# Altium schematic sheet 03_ICs.SchDoc: ICs
size A; Revision: A; SheetNumber: 3; SheetTotal: 4; ECE315_Project_Name: ECE453 F23 Base Project
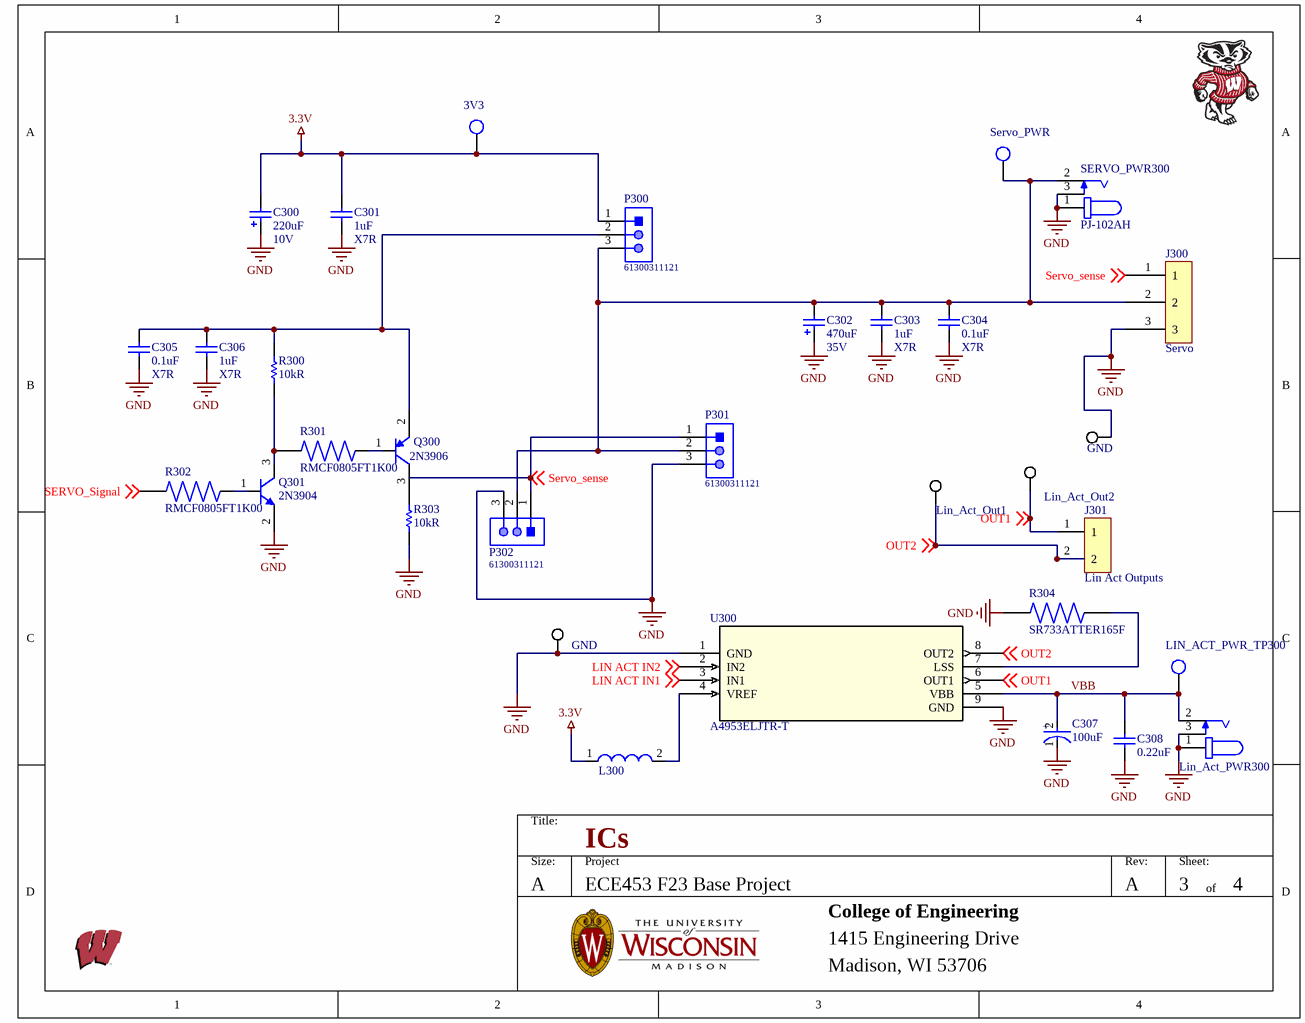
[diagram p0: 03_ICs.SchDoc]

## Parts
(Parts that share a designator on the sheet are numbered #1, #2 ... from top to bottom, then left to right.)
3V3  TP_1206  [TP-SMC-1206]  (value not drawn)
C300  Voltage: 10V  [CAPPR2-5x11]  (hidden comment: 220uF)
C301  Dielectric: X7R  [CAPC2012M]  (hidden comment: 1uF)
C302  Voltage: 35V  [CAPPR5-10x12.5]  (hidden comment: 470uF)
C303  Dielectric: X7R  [CAPC2012M]  (hidden comment: 1uF)
C304  Dielectric: X7R  [CAPC2012M]  (hidden comment: 0.1uF)
C305  Dielectric: X7R  [CAPC2012M]  (hidden comment: 0.1uF)
C306  Dielectric: X7R  [CAPC2012M]  (hidden comment: 1uF)
C307  Capacitance: 100uF  [FP-SD8-MFG]  (hidden comment: EEE-1EA101XP)
C308  0.22uF  [CAPC2012M]
GND#1  5019  [KSTN-5019_V]  (value not drawn)
GND#2  5019  [KSTN-5019_V]  (value not drawn)
J300  Servo  [PHOENIX3X0.2]
J301  Lin Act Outputs  [PHOENIX2X0.2]
L300  742792093  [SMD-0805]  (value not drawn)
Lin_Act_Out1  5019  [KSTN-5019_V]  (value not drawn)
Lin_Act_Out2  5019  [KSTN-5019_V]  (value not drawn)
Lin_Act_PWR300  (no value)  [CUI_PJ-102AH]
LIN_ACT_PWR_TP300  TP_1206  [TP-SMC-1206]  (value not drawn)
P300  61300311121  [61300311121]
P301  61300311121  [61300311121]
P302  61300311121  [61300311121]
Q300  2N3906  [SOT23-3M]
Q301  2N3904  [SOT23-3M]
R300  Resistance: 10kR  [RESC2013X60X35NL10T20]  (hidden comment: RC0805FR-0710KL)
R301  RMCF0805FT1K00  [RESC2012X65N]
R302  RMCF0805FT1K00  [RESC2012X65N]
R303  Resistance: 10kR  [RESC2013X60X35NL10T20]  (hidden comment: RC0805FR-0710KL)
R304  SR733ATTER165F  [RESC6432X70N]
Servo_PWR  TP_1206  [TP-SMC-1206]  (value not drawn)
SERVO_PWR300  PJ-102AH  [CUI_PJ-102AH]
U300  A4953ELJTR-T  [SOIC-8_ALM]

## Nets
3.3V: 3V3.1 C300.2 C301.2 L300.1 P300.1
GND: C300.1 C301.1 C302.1 C303.1 C304.1 C305.1 C306.1 C307.1(C) C308.2 GND#1.1 GND#2.1 J300.3 Lin_Act_PWR300.1 Lin_Act_PWR300.3 P301.3 P302.3 Q301.2(E) R303.1 R304.1 SERVO_PWR300.1 SERVO_PWR300.3 U300.1(GND) U300.9(GND)
LIN ACT IN1: U300.3(IN1) ; off-sheet LIN ACT IN1
LIN ACT IN2: U300.2(IN2) ; off-sheet LIN ACT IN2
OUT1: J301.1 Lin_Act_Out2.1 U300.6(OUT1) ; off-sheet OUT1
OUT2: J301.2 Lin_Act_Out1.1 U300.8(OUT2) ; off-sheet OUT2
Servo_sense: J300.1 P301.1 P302.1 ; off-sheet Servo_sense
SERVO_Signal: R302.1 ; off-sheet SERVO_Signal
VBB: C307.2(A) C308.1 Lin_Act_PWR300.2 LIN_ACT_PWR_TP300.1 U300.5(VBB)
NetC302_2: C302.2 C303.2 C304.2 J300.2 P300.3 P301.2 P302.2 Servo_PWR.1 SERVO_PWR300.2
NetC305_2: C305.2 C306.2 P300.2 Q300.2(E) R300.2
NetL300_2: L300.2 U300.4(VREF)
NetQ300_1: Q300.1(B) R301.2
NetQ300_3: Q300.3(C) R303.2
NetQ301_1: Q301.1(B) R302.2
NetQ301_3: Q301.3(C) R300.1 R301.1
NetR304_2: R304.2 U300.7(LSS)

## Notes on the sheet
- Title:
- Size:
- A
- Project
- Rev:
- Sheet:
- of
- College of Engineering
- 1415 Engineering Drive
- Madison, WI 53706
- (in symbol CMP-05427-000061-1) +

## Library data of the parts
3V3 LIN_ACT_PWR_TP300 Servo_PWR = TP_1206: Test Point SMD 1206; Manufacturer: TE Connectivity (Tyco Electronics); Manufacturer Part Number: 1625854-1; Resistance Value: 0 Ohm; Temperature Coefficient: N/R; Supplier: Digi-Key; Stock 1: 31937; Pricing 1: 1=0.28, 10=0.261, 25=0.224, 50=0.1902, 100=0.1828, 250=0.1641, 500=0.1567, 1000=0.1306 (USD); Case Size: 1206; Dimension: 3.2 x 1.6 x 1.25mm; Family: RC; Mounting: Surface Mount; Operating Temperature: -55 to 125 C; Part No: 1625854-1; RoHS: Yes; Packaging: Tape and Reel; Termination Style: N/R; Terminal Pitch: N/R; Power Rating: N/R; Tolerance: N/R; ComponentLink1URL: https://datasheet.ciiva.com/6439/eng-ds-1773266-a-6439169.pdf; ComponentLink1Description: https://datasheet.ciiva.com/6439/eng-ds-1773266-a-6439169.pdf; ComponentLink2URL: https://datasheet.ciiva.com/30136/1773266-a-30136341.pdf; ComponentLink2Description: https://datasheet.ciiva.com/30136/1773266-a-30136341.pdf; ComponentLink3URL: https://datasheet.ciiva.com/6439/eng-ds-1773266-a-6439080.pdf; ComponentLink3Description: https://datasheet.ciiva.com/6439/eng-ds-1773266-a-6439080.pdf; ComponentLink4URL: https://datasheet.ciiva.com/6439/eng-ds-1773266-a-6439081.pdf; ComponentLink4Description: https://datasheet.ciiva.com/6439/eng-ds-1773266-a-6439081.pdf; ComponentLink5URL: https://datasheet.ciiva.com/6439/eng-ds-1773266-a-6439083.pdf; ComponentLink5Description: https://datasheet.ciiva.com/6439/eng-ds-1773266-a-6439083.pdf; Supplier Part Number: A106143CT-ND
C300 = Cap Pol1: Capacitor Al 105deg 220uF 10V 5X11; Manufacturer: Rubycon; Manufacturer Part Number: 10YXJ220M5X11; Tolerance: 20%; Ripple Current: 250mA; Impedance: 400mR; Leakage Current: 3uA; Life (Hours): 4000Hour; Lead Diameter: 0.5mm; Supplier: Digi-Key; Supplier Part Number: 1189-4150-ND; RoHS: Yes; Category: Aluminum Electrolytic Capacitors; Stock 1: 94; Pricing 1: 1=0.26000, 10=0.17500, 50=0.11680, 100=0.09930, 500=0.07010, 1000=0.06134, 2500=0.05842, 5000=0.05404 (USD); Mount: Through Hole; Case/Package: Radial; Min Operating Temperature: -40°C; Max Operating Temperature: 105°C; Capacitance: 220uF; Termination: Radial; Package Quantity: 3000; Packaging: Bulk; Voltage Rating: 10V; Series: YXJ; Construction: RADIAL; Diameter: 5mm; Height: 11mm; Lead Pitch: 2mm; Height - Seated (Max): 0.492inch; Radiation Hardening: No; RoHS Compliant: Yes; ComponentLink1URL: https://datasheet.ciiva.com/11777/0900766b810307a1-11777018.pdf?src-supplier=RSComponents; ComponentLink1Description: https://datasheet.ciiva.com/11777/0900766b810307a1-11777018.pdf?src-supplier=RSComponents; ComponentLink2URL: https://datasheet.ciiva.com/6318/e-yxj-6318863.pdf?src-supplier=Digi-Key; ComponentLink2Description: https://datasheet.ciiva.com/6318/e-yxj-6318863.pdf?src-supplier=Digi-Key; ComponentLink3URL: https://datasheet.ciiva.com/11690/e-yxj-11690699.pdf?src-supplier=Avnet; ComponentLink3Description: https://datasheet.ciiva.com/11690/e-yxj-11690699.pdf?src-supplier=Avnet; Value: 220uF
C301 C306 = Cap_5: CAP CER 1UF 50V X7R 0805; Manufacturer: Samsung; Manufacturer Part Number: CL21B105KBFNNNE; Tolerance: 10%; Dielectric Material: Ceramic; Value: 1uF; Case Code (Metric): 2012; Min Operating Temperature: -55°C; Mount: Surface Mount; Width: 0.049inch; Voltage Rating (DC): 50V; Voltage Rating: 50V; Height: 1.25mm; Case Code (Imperial): 0805; Supplier: Digi-Key; Supplier Part Number: 1276-1029-6-ND; Capacitance: 1uF; Case/Package: 0805; Construction: Flat; Max Operating Temperature: 125°C; REACH SVHC: No SVHC; Voltage: 50V; Packaging: Tape and Reel; Depth: 1.25mm; Package Quantity: 1; Radiation Hardening: No; Series: CL; Length: 2mm; Thickness: 0.053inch; Termination: SMD/SMT; Number of Pins: 2; RoHS Compliant: Yes
C302 = Cap Pol3: CAP ALUM 470UF 20% 35V RADIAL; Manufacturer: Rubycon; Manufacturer Part Number: 35ZL470MEFC10X20; Leakage Current: 3uA; Lead Diameter: 0.6mm; Dielectric Material: Aluminium; Life (Hours): 4000Hour; Ripple Current: 1.82A; Impedance: 23mR; Case/Package: Radial; Max Operating Temperature: 105°C; REACH SVHC: Unknown; Min Operating Temperature: -40°C; Supplier Part Number: 35ZL470MEFC10X20-ND; Packaging: Bulk; Lead Pitch: 5mm; Diameter: 10mm; Capacitance: 470uF; Lead Free: Lead Free; Radiation Hardening: No; Package Quantity: 1000; Height: 20mm; Voltage Rating: 35V; Mount: Through Hole; Supplier: Digi-Key; Height - Seated (Max): 0.866inch; Tolerance: 20%; Termination: Radial; Value: 470uF
C303 = Cap: CAP CER 1UF 50V X7R 0805; Manufacturer: Samsung; Manufacturer Part Number: CL21B105KBFNNNE; Tolerance: 10%; Dielectric Material: Ceramic; Case Code (Metric): 2012; Min Operating Temperature: -55°C; Mount: Surface Mount; Width: 0.049inch; Voltage Rating (DC): 50V; Voltage Rating: 50V; Height: 1.25mm; Case Code (Imperial): 0805; Supplier: Digi-Key; Supplier Part Number: 1276-1029-6-ND; Capacitance: 1uF; Case/Package: 0805; Construction: Flat; Max Operating Temperature: 125°C; REACH SVHC: No SVHC; Voltage: 50V; Packaging: Tape and Reel; Depth: 1.25mm; Package Quantity: 1; Radiation Hardening: No; Series: CL; Length: 2mm; Thickness: 0.053inch; Termination: SMD/SMT; Number of Pins: 2; RoHS Compliant: Yes; Value: 1uF
C304 C305 = Cap_1: Cap Ceramic 0.1uF 50V X7R 20% SMD 0805 125°C Plastic T/R; Manufacturer: KEMET; Manufacturer Part Number: C0805C104M5RAC7210; Supplier: Digi-Key; Supplier Part Number: 399-C0805C104M5RAC7210CT-ND; RoHS: Yes; Category: Ceramic Capacitors; Stock 1: 29705; Pricing 1: 1=0.10000, 10=0.05900, 50=0.03220, 100=0.02620, 500=0.01874, 1000=0.01472, 2500=0.01338, 5000=0.01231 (USD); Mounting Technology: Surface Mount; Case/Package: 0805; Dielectric Material: Ceramic; Min Operating Temperature: -55°C; Max Operating Temperature: 125°C; Packaging: Tape and Reel; Tolerance: 20%; Voltage Rating (DC): 50V; Construction: Flat; Length: 2mm; Height: 0.9mm; Depth: 1.25mm; Radiation Hardening: No; RoHS Compliant: Yes; ComponentLink1URL: https://datasheet.ciiva.com/26923/getdatasheetpartid-738954-26923963.pdf?src-supplier=Verical; ComponentLink1Description: https://datasheet.ciiva.com/26923/getdatasheetpartid-738954-26923963.pdf?src-supplier=Verical; Value: 0.1uF
C307 = CMP-05427-000061-1: CAP ALUM 100UF 20% 25V SMD; Manufacturer: Panasonic; Leakage Current: 3uA; Life (Hours): 2000Hour; Ripple Current: 143mA; Polarity: Polar; Height - Seated (Max): 0.303inch; Contact Plating: Tin; Max Operating Temperature: 85°C; Package Quantity: 900; RoHS Compliant: Yes; Termination: SMD/SMT; Lead Free: Lead Free; Min Operating Temperature: -40°C; Radiation Hardening: No; Length: 8mm; Height: 7.7mm; Series: S; Voltage Rating: 25V; Diameter: 6.3mm; Ripple Current (AC): 143mA; Case/Package: Radial; Packaging: Tape and Reel; Voltage: 25V; Tolerance: 20%; Construction: Cylindrical; Voltage Rating (DC): 25V; Mount: Surface Mount; Supplier: Newark; Supplier Part Number: 47AC4798; Manufacturer Part Number: EEE-1EA101XP; RoHS: Yes; Category: Aluminum Electrolytic Capacitors; Stock: 12600; Pricing: 1=0.166, 900=0.162, 1800=0.158 (USD); Mounting Technology: Surface Mount,PCB; Value: 100uF; Ratings: AEC-Q200; Reach SVHC Compliant: Unknown; ComponentLink1URL: https://media.digikey.com/pdf/Data%20Sheets/Panasonic%20Electronic%20Components/S_Series,Type_V_Rev2018.pdf?src-supplier=Digi-Key; ComponentLink1Description: https://media.digikey.com/pdf/Data%20Sheets/Panasonic%20Electronic%20Components/S_Series,Type_V_Rev2018.pdf?src-supplier=Digi-Key; ComponentLink2URL: https://industrial.panasonic.com/cdbs/www-data/pdf/RDE0000/DME0000COL90.pdf?src-supplier=Digi-Key; ComponentLink2Description: https://industrial.panasonic.com/cdbs/www-data/pdf/RDE0000/DME0000COL90.pdf?src-supplier=Digi-Key; ComponentLink3URL: https://industrial.panasonic.com/cdbs/www-data/pdf/RDE0000/DME0000COL90.pdf?src-supplier=Arrow+Electronics; ComponentLink3Description: https://industrial.panasonic.com/cdbs/www-data/pdf/RDE0000/DME0000COL90.pdf?src-supplier=Arrow+Electronics
C308 = Cap_2: Cap Ceramic 0.22uF 50V X7R 10% SMD 0805 125°C Plastic T/R; Manufacturer: KEMET; Manufacturer Part Number: C0805C224K5RACAUTO7210; Supplier 1: Digi-Key; Supplier Part Number 1: 399-C0805C224K5RACAUTO7210CT-ND; RoHS: Yes; Category: Ceramic Capacitors; Stock 1: 24243; Pricing 1: 1=0.19000, 10=0.12800, 50=0.07680, 100=0.06490, 500=0.04438, 1000=0.03926, 2500=0.03755, 5000=0.03414 (USD); RoHS Compliant: Yes; Value: 0.22uF
GND#1 GND#2 Lin_Act_Out1 Lin_Act_Out2 = CMP-1672-00008-1: Test Point, 1 Position SMD, RoHS, Tape and Reel; Manufacturer: Keystone Electronics; Plating: Silver; Body Material: Bronze; Supplier: Newark; Supplier Part Number: 59Y8500; Manufacturer Part Number: 5019; RoHS: Yes; Category: Connectors; Stock: 11269; Pricing: 1=0.411, 10=0.389, 25=0.285, 50=0.279, 100=0.273, 250=0.246 (USD); Mounting Technology: Surface Mount,PCB; Pins: 1; Contact Plating: Silver; Contact Material: Bronze; Material: Bronze; Packaging: Tape and Reel; Package Quantity: 1; Termination: SMD/SMT; Series: 5019; Height: 0.09inch; Reach SVHC Compliant: No; RoHS Compliant: Yes; Lead Free: Lead Free; ComponentLink1URL: https://datasheet.ciiva.com/14848/m60-2p61-14848437.pdf?src-supplier=Digi-Key; ComponentLink1Description: https://datasheet.ciiva.com/14848/m60-2p61-14848437.pdf?src-supplier=Digi-Key; ComponentLink2URL: https://datasheet.ciiva.com/14848/m60-2p61-14848438.pdf?src-supplier=Digi-Key; ComponentLink2Description: https://datasheet.ciiva.com/14848/m60-2p61-14848438.pdf?src-supplier=Digi-Key; ComponentLink3URL: https://datasheet.ciiva.com/14848/m60-2p61-14848439.pdf?src-supplier=Digi-Key; ComponentLink3Description: https://datasheet.ciiva.com/14848/m60-2p61-14848439.pdf?src-supplier=Digi-Key; ComponentLink4URL: https://datasheet.ciiva.com/16318/m60-2p61-16318395.pdf?src-supplier=Future+Electronics; ComponentLink4Description: https://datasheet.ciiva.com/16318/m60-2p61-16318395.pdf?src-supplier=Future+Electronics; ComponentLink5URL: https://datasheet.ciiva.com/16885/70182998-16885945.pdf?src-supplier=Allied+Electronics; ComponentLink5Description: https://datasheet.ciiva.com/16885/70182998-16885945.pdf?src-supplier=Allied+Electronics
J300 = 3-Pin_2: 2~24 Poles, Screw Type, Horizontal, 5.08 Pitch, 26~14 (AWG), Terminal Block Connector; Manufacturer: CUI Devices; Manufacturer Part Number: TB006-508-03BE; Supplier 1: Digi-Key; Supplier Part Number 1: 102-6192-ND; RoHS: Yes; Category: Terminal Blocks; Stock 1: 41909; Pricing 1: 1=0.91, 10=0.567, 25=0.4856, 50=0.4364, 100=0.4272, 250=0.3636, 500=0.34542, 1000=0.30906, 5000=0.24179 (USD)
J301 = 2-Pin_2: 2~24 Poles, Screw Type, Horizontal, 5.08 Pitch, 26~14 (AWG), Terminal Block Connector; Manufacturer: CUI Devices; Manufacturer Part Number: TB006-508-02BE; ComponentLink1URL: https://datasheet.ciiva.com/709/eng-cd-640456-w1-709680.pdf?src-supplier=Digi-Key; ComponentLink1Description: https://datasheet.ciiva.com/709/eng-cd-640456-w1-709680.pdf?src-supplier=Digi-Key; ComponentLink2URL: https://datasheet.ciiva.com/3118/eng-ds-82056-mta-0608-3118497.pdf?src-supplier=Avnet; ComponentLink2Description: https://datasheet.ciiva.com/3118/eng-ds-82056-mta-0608-3118497.pdf?src-supplier=Avnet; ComponentLink3URL: https://datasheet.ciiva.com/16401/eng-ds-82056-mta-0608-16401289.pdf?src-supplier=Future+Electronics; ComponentLink3Description: https://datasheet.ciiva.com/16401/eng-ds-82056-mta-0608-16401289.pdf?src-supplier=Future+Electronics; ComponentLink4URL: https://datasheet.ciiva.com/25617/0900766b80027008-25617244.pdf?src-supplier=RSComponents; ComponentLink4Description: https://datasheet.ciiva.com/25617/0900766b80027008-25617244.pdf?src-supplier=RSComponents; ComponentLink5URL: https://datasheet.ciiva.com/14156/04384301-14156820.pdf?src-supplier=Distrelec; ComponentLink5Description: https://datasheet.ciiva.com/14156/04384301-14156820.pdf?src-supplier=Distrelec; ComponentLink6URL: https://datasheet.ciiva.com/11746/0900766b80eb7fdd-11746365.pdf?src-supplier=RSComponents; ComponentLink6Description: https://datasheet.ciiva.com/11746/0900766b80eb7fdd-11746365.pdf?src-supplier=RSComponents; ComponentLink7URL: https://datasheet.ciiva.com/7128/1866390-7128742.pdf?src-supplier=Newark; ComponentLink7Description: https://datasheet.ciiva.com/7128/1866390-7128742.pdf?src-supplier=Newark; ComponentLink8URL: https://datasheet.ciiva.com/16505/eng-ds-82056-mta-0608-16505419.pdf?src-supplier=Avnet+Asia; ComponentLink8Description: https://datasheet.ciiva.com/16505/eng-ds-82056-mta-0608-16505419.pdf?src-supplier=Avnet+Asia; Supplier: Digi-Key; Supplier Part Number: 102-6191-ND; RoHS: Yes; Category: Terminal Blocks; Stock 1: 50889; Pricing 1: 1=0.86, 10=0.472, 25=0.3524, 50=0.3142, 100=0.308, 250=0.27108, 500=0.24644, 1000=0.2218, 5000=0.16635 (USD)
L300 = CMP-0220-00169-1: SMD EMI Suppression Ferrite Bead WE-CBF, Z = 2200 Ohm; Manufacturer: Wurth Electronics; Current Rating: 200mA; Tolerance: 25%; Number of Lines: 1; DC Resistance (DCR): 600mR; Test Frequency: 100MHz; Value: 3.9nH; Shielding: Unshielded; DatasheetVersion: Dec-2005; ComponentLink2URL: http://www.we-online.de/katalog/media/pdf/742792093.pdf; PackageDescription: Chip Inductor, 2-Leads, Body 2.0 x 1.2 mm; Impedance: 2200 Ohm; ComponentLink2Description: Datasheet; ComponentLink1Description: Manufacturer Link; PackageReference: SMD-0805; ComponentLink1URL: http://www.we-online.com; PackageVersion: 2005; Supplier: Newark; Supplier Part Number: 24AC5609; Manufacturer Part Number: 742792093; RoHS: Yes; Category: Ferrite Beads and Chips; Stock: 32000; Pricing: 1=0.145, 4000=0.145 (USD); Mounting Technology: Surface Mount; Case/Package: SMD/SMT; Case Code (Metric): 2012; Case Code (Imperial): 0805; Core Material: Ferrite; Weight: 0.000388oz; Min Operating Temperature: -55°C; Max Operating Temperature: 125°C; Package Quantity: 1; Packaging: Tape and Reel; Max Current Rating: 200mA; Max DC Current: 200mA; Termination: SMD/SMT; Series: WE-CBF; Length: 2mm; Width: 1.2mm; Height: 0.9mm; Depth: 1.2mm; RoHS Compliant: Yes; Reach SVHC Compliant: Unknown; Lead Free: Lead Free; ComponentLink3URL: https://datasheet.ciiva.com/1475/742792093-1475025.pdf?src-supplier=Farnell; ComponentLink3Description: https://datasheet.ciiva.com/1475/742792093-1475025.pdf?src-supplier=Farnell; ComponentLink4URL: https://datasheet.ciiva.com/1013/742792093-1013376.pdf?src-supplier=Digi-Key; ComponentLink4Description: https://datasheet.ciiva.com/1013/742792093-1013376.pdf?src-supplier=Digi-Key; ComponentLink5URL: https://datasheet.ciiva.com/4940/742792093-88569-4940476.pdf?src-supplier=Mouser; ComponentLink5Description: https://datasheet.ciiva.com/4940/742792093-88569-4940476.pdf?src-supplier=Mouser; ComponentLink6URL: https://datasheet.ciiva.com/11799/0900766b80bbd134-11799557.pdf?src-supplier=Rs; ComponentLink6Description: https://datasheet.ciiva.com/11799/0900766b80bbd134-11799557.pdf?src-supplier=Rs; ComponentLink7URL: https://datasheet.ciiva.com/14122/742792093-eng-tds-14122810.pdf?src-supplier=Distrelec; ComponentLink7Description: https://datasheet.ciiva.com/14122/742792093-eng-tds-14122810.pdf?src-supplier=Distrelec
Lin_Act_PWR300 SERVO_PWR300 = PJ-102AH: 2.0 mm Center Pin, 5.0 A, Right Angle, Through Hole, Tapered Pins, Dc Power Jack Connector <a href="https://pricing.snapeda.com/parts/PJ-102AH/CUI%20Devices/view-part?ref=eda">Check availability</a> <a href="https://pricing.snapeda.com/parts/PJ-102AH/CUI%20Devices/view-part?ref=eda">Check availability</a>; MF: {'manufacturer': u'CUI'}; Package: None; Price: None; Value: *; MP: PJ-102AH; Availability: Unavailable
P300-P302 = CMP-1502-01062-1: THT Vertical Pin Header WR-PHD, Pitch 2.54 mm, Single Row, 3 pins; Manufacturer: Wurth Elektronik; Manufacturer 1: Wurth Electronics; Withstanding Voltage: 500VAC; Working Voltage: 250VAC; Rated Current: 3A; Pitch: 2.54mm; Pin Number: 3; Gender: Male; Contact Resistance: 20mOhm; Package Reference: 61300311121; Manufacturer URL: http://www.we-online.de; Datasheet URL: https://katalog.we-online.de/em/datasheet/6130xx11121.pdf; Operating Temperature: -40to105degC; Part Number: 61300311121; Orientation: Vertical; Packaging: Bag; Row Number: Single; Mounting Technology: THT; Publisher: WurthElektronik; Supplier 1: Digi-Key; Supplier Part Number 1: 732-5316-ND; Manufacturer Part Number 1: 61300311121; RoHS: Yes; Category: Connectors; Stock 1: 225106; Pricing 1: 1=0.13, 10=0.113, 25=0.094, 50=0.079, 100=0.071, 1000=0.066 (USD); Mount: Through Hole; Contact Plating: Gold; Contact Material: Copper; Color: Black; Number of Rows: 1; Number of Positions: 3; Termination: Solder; Number of Contacts: 3; Series: WR-PHD; Contact Type: Male Pin; Contact Mating Length: 0.236inch; Lead Free: Lead Free; RoHS Compliant: Yes; Reach SVHC Compliant: Unknown; ComponentLink1URL: http://www.farnell.com/cad/1737268.pdf?src-supplier=Element14; ComponentLink1Description: http://www.farnell.com/cad/1737268.pdf?src-supplier=Element14; ComponentLink2URL: https://katalog.we-online.de/em/datasheet/6130xx11121.pdf?src-supplier=Digi-Key; ComponentLink2Description: https://katalog.we-online.de/em/datasheet/6130xx11121.pdf?src-supplier=Digi-Key; Supplier: Newark; Supplier Part Number: 20X0950; Manufacturer Part Number: 61300311121; Stock: 65141; Pricing: 1=0.133, 10=0.115, 25=0.096, 50=0.081, 100=0.072 (USD); ComponentLink3URL: https://datasheet.octopart.com/61300311121-W%C3%BCrth-Elektronik-datasheet-21154836.pdf?src-supplier=Element14; ComponentLink3Description: https://datasheet.octopart.com/61300311121-W%C3%BCrth-Elektronik-datasheet-21154836.pdf?src-supplier=Element14
Q300 = 2N3906: TRANS PNP 40V 0.2A SOT23; Manufacturer Part Number: MMBT3906LT1G; Manufacturer: ON Semiconductor; Current - Collector (Ic) (Max): 200mA; Vce Saturation (Max) @ Ib, Ic: 400mV @ 5mA, 50mA; DC Current Gain (hFE) (Min) @ Ic, Vce: 100 @ 10mA, 1V; Power - Max: 300mW; Frequency - Transition: 250MHz; Transistor Type: PNP; Category: Discrete Semiconductor Products; RoHS: RoHS Compliant; Supplier: Digi-Key; Supplier Part Number: MMBT3906LT1GOSCT-ND; Packaging: Cut Tape (CT); Voltage - Collector Emitter Breakdown (Max): 40V; Mounting Type: Surface Mount; Supplier Device Package: SOT-23-3 (TO-236); Package / Case: TO-236-3, SC-59, SOT-23-3; Value: 2N3906
Q301 = 2N3904: NPN General Purpose Amplifier; Manufacturer Part Number: MMBT3904-7-F; Manufacturer: Diodes Incorporated; Frequency - Transition: 300MHz; Power - Max: 300mW; DC Current Gain (hFE) (Min) @ Ic, Vce: 100 @ 10mA, 1V; Current - Collector Cutoff (Max): 50nA (ICBO); Vce Saturation (Max) @ Ib, Ic: 300mV @ 5mA, 50mA; Voltage - Collector Emitter Breakdown (Max): 40V; Current - Collector (Ic) (Max): 200mA; Supplier Device Package: SOT-23-3; Mounting Type: Surface Mount; Transistor Type: NPN; Packaging: Cut Tape (CT); RoHS: RoHS Compliant; Package / Case: TO-236-3, SC-59, SOT-23-3; Supplier Part Number: MMBT3904-FDICT-ND; Supplier: Digi-Key; Category: Discrete Semiconductor Products; Value: 2N3904
R300 R303 = CMP-1659-00013-4: Chip Resistor, 10 KOhm, +/- 1%, 0.125 W, -55 to 155 degC, 0805 (2012 Metric), RoHS, Tape and Reel; Manufacturer: Yageo; Voltage Rating: 150 V; Temperature Coefficient: 100ppm/°C; Power Rating: 125mW; Value: 10kR; Mount: Surface Mount; ComponentLink1Description: Manufacturer URL; ComponentLink2URL: http://www.yageo.com/documents/recent/PYu-RC_Group_51_RoHS_L_04.pdf; Pins: 2; Length: 2 mm; Min Operating Temperature: -55 degC; Height: 0.5 mm; Mounting Technology: Surface Mount; RoHSCompliant: true; REACH SVHC: No SVHC; ComponentLink1URL: http://www.yageo.com/; Max Operating Temperature: 155 degC; PackageReference: 0805; DatasheetVersion: Rev. 4, 02/2016; Package Quantity: 5000; Packaging: Tape and Reel; ComponentLink2Description: Datasheet; PackageDescription: 2-Pin Surface Mounted Device, Body 2 x 1.25 mm; Supplier 1: Digi-Key; Supplier Part Number 1: 311-10.0KCRCT-ND; Manufacturer 1: Yageo; Manufacturer Part Number 1: RC0805FR-0710KL; RoHS: Yes; Category: Chip SMD Resistors; Stock 1: 5682818; Pricing 1: 1=0.10000, 10=0.03800, 100=0.01560, 1000=0.00702, 2500=0.00610 (USD); Case/Package: 0805; Case Code (Imperial): 0805; Case Code (Metric): 2012; Size Code: 0805; Tolerance: 1%; Resistor Type: Thick Film; Series: RC; Number of Terminations: 2; Max Power Dissipation: 125mW; Termination: SMD/SMT; Features: Moisture Resistant; Construction: Rectangular; Resistance Tolerance: 1%; Technology: THICK FILM; Width: 0.049inch; Depth: 1.25mm; RoHS Compliant: Yes; Military Standard: Not; Lead Free: Lead Free; ComponentLink3URL: https://datasheet.ciiva.com/11808/0900766b8106beab-11808151.pdf?src-supplier=RSComponents; ComponentLink3Description: https://datasheet.ciiva.com/11808/0900766b8106beab-11808151.pdf?src-supplier=RSComponents; ComponentLink4URL: https://datasheet.ciiva.com/46447/444164-46447563.pdf?src-supplier=Element14; ComponentLink4Description: https://datasheet.ciiva.com/46447/444164-46447563.pdf?src-supplier=Element14; ComponentLink5URL: https://datasheet.ciiva.com/2456/pyu-r-int-thick-7-2456973.pdf?src-supplier=Digi-Key; ComponentLink5Description: https://datasheet.ciiva.com/2456/pyu-r-int-thick-7-2456973.pdf?src-supplier=Digi-Key; ComponentLink6URL: https://datasheet.ciiva.com/2456/pyu-r-int-thick-7-2456974.pdf?src-supplier=Digi-Key; ComponentLink6Description: https://datasheet.ciiva.com/2456/pyu-r-int-thick-7-2456974.pdf?src-supplier=Digi-Key; ComponentLink7URL: https://datasheet.ciiva.com/2456/pyu-r-int-thick-7-2456972.pdf?src-supplier=Digi-Key; ComponentLink7Description: https://datasheet.ciiva.com/2456/pyu-r-int-thick-7-2456972.pdf?src-supplier=Digi-Key; ComponentLink8URL: https://datasheet.ciiva.com/12669/rc0805-12669688.pdf?src-supplier=Mouser; ComponentLink8Description: https://datasheet.ciiva.com/12669/rc0805-12669688.pdf?src-supplier=Mouser; ComponentLink9URL: https://datasheet.ciiva.com/16747/rc0805-16747087.pdf?src-supplier=Future+Electronics; ComponentLink9Description: https://datasheet.ciiva.com/16747/rc0805-16747087.pdf?src-supplier=Future+Electronics; Supplier: Newark; Supplier Part Number: 05M4535; Manufacturer Part Number: RC0805FR-0710KL; Stock: 346650; Pricing: 1=0.102, 10=0.035, 25=0.028, 50=0.021, 100=0.014 (USD); Reach SVHC Compliant: Unknown; ComponentLink10URL: https://datasheet.ciiva.com/11808/0900766b8106beab-11808151.pdf?src-supplier=Rs; ComponentLink10Description: https://datasheet.ciiva.com/11808/0900766b8106beab-11808151.pdf?src-supplier=Rs
R304 = SR733ATTER165F: 2512 Lo-ohm Thick Film Current Sense Resistors 1watts 0.165ohms 1%; Package: None; Price: None; Value: *; MP: SR733ATTER165F; Availability: Unavailable
U300 = A4953ELJTR-T: No Description Available; Mfr_Name: Allegro Microsystems Inc.; Copyright: Copyright (C) 2023 Ultra Librarian. All rights reserved.; Manufacturer_Part_Number: A4953ELJTR-T; RefDes: RefDes; Type: DEV
R301 R302 = RMCF0805FT1K00: Package: None; Price: None; Value: *; MP: RMCF0805FT1K00; Availability: Unavailable